# Altium schematic sheet driver.SchDoc
size A3
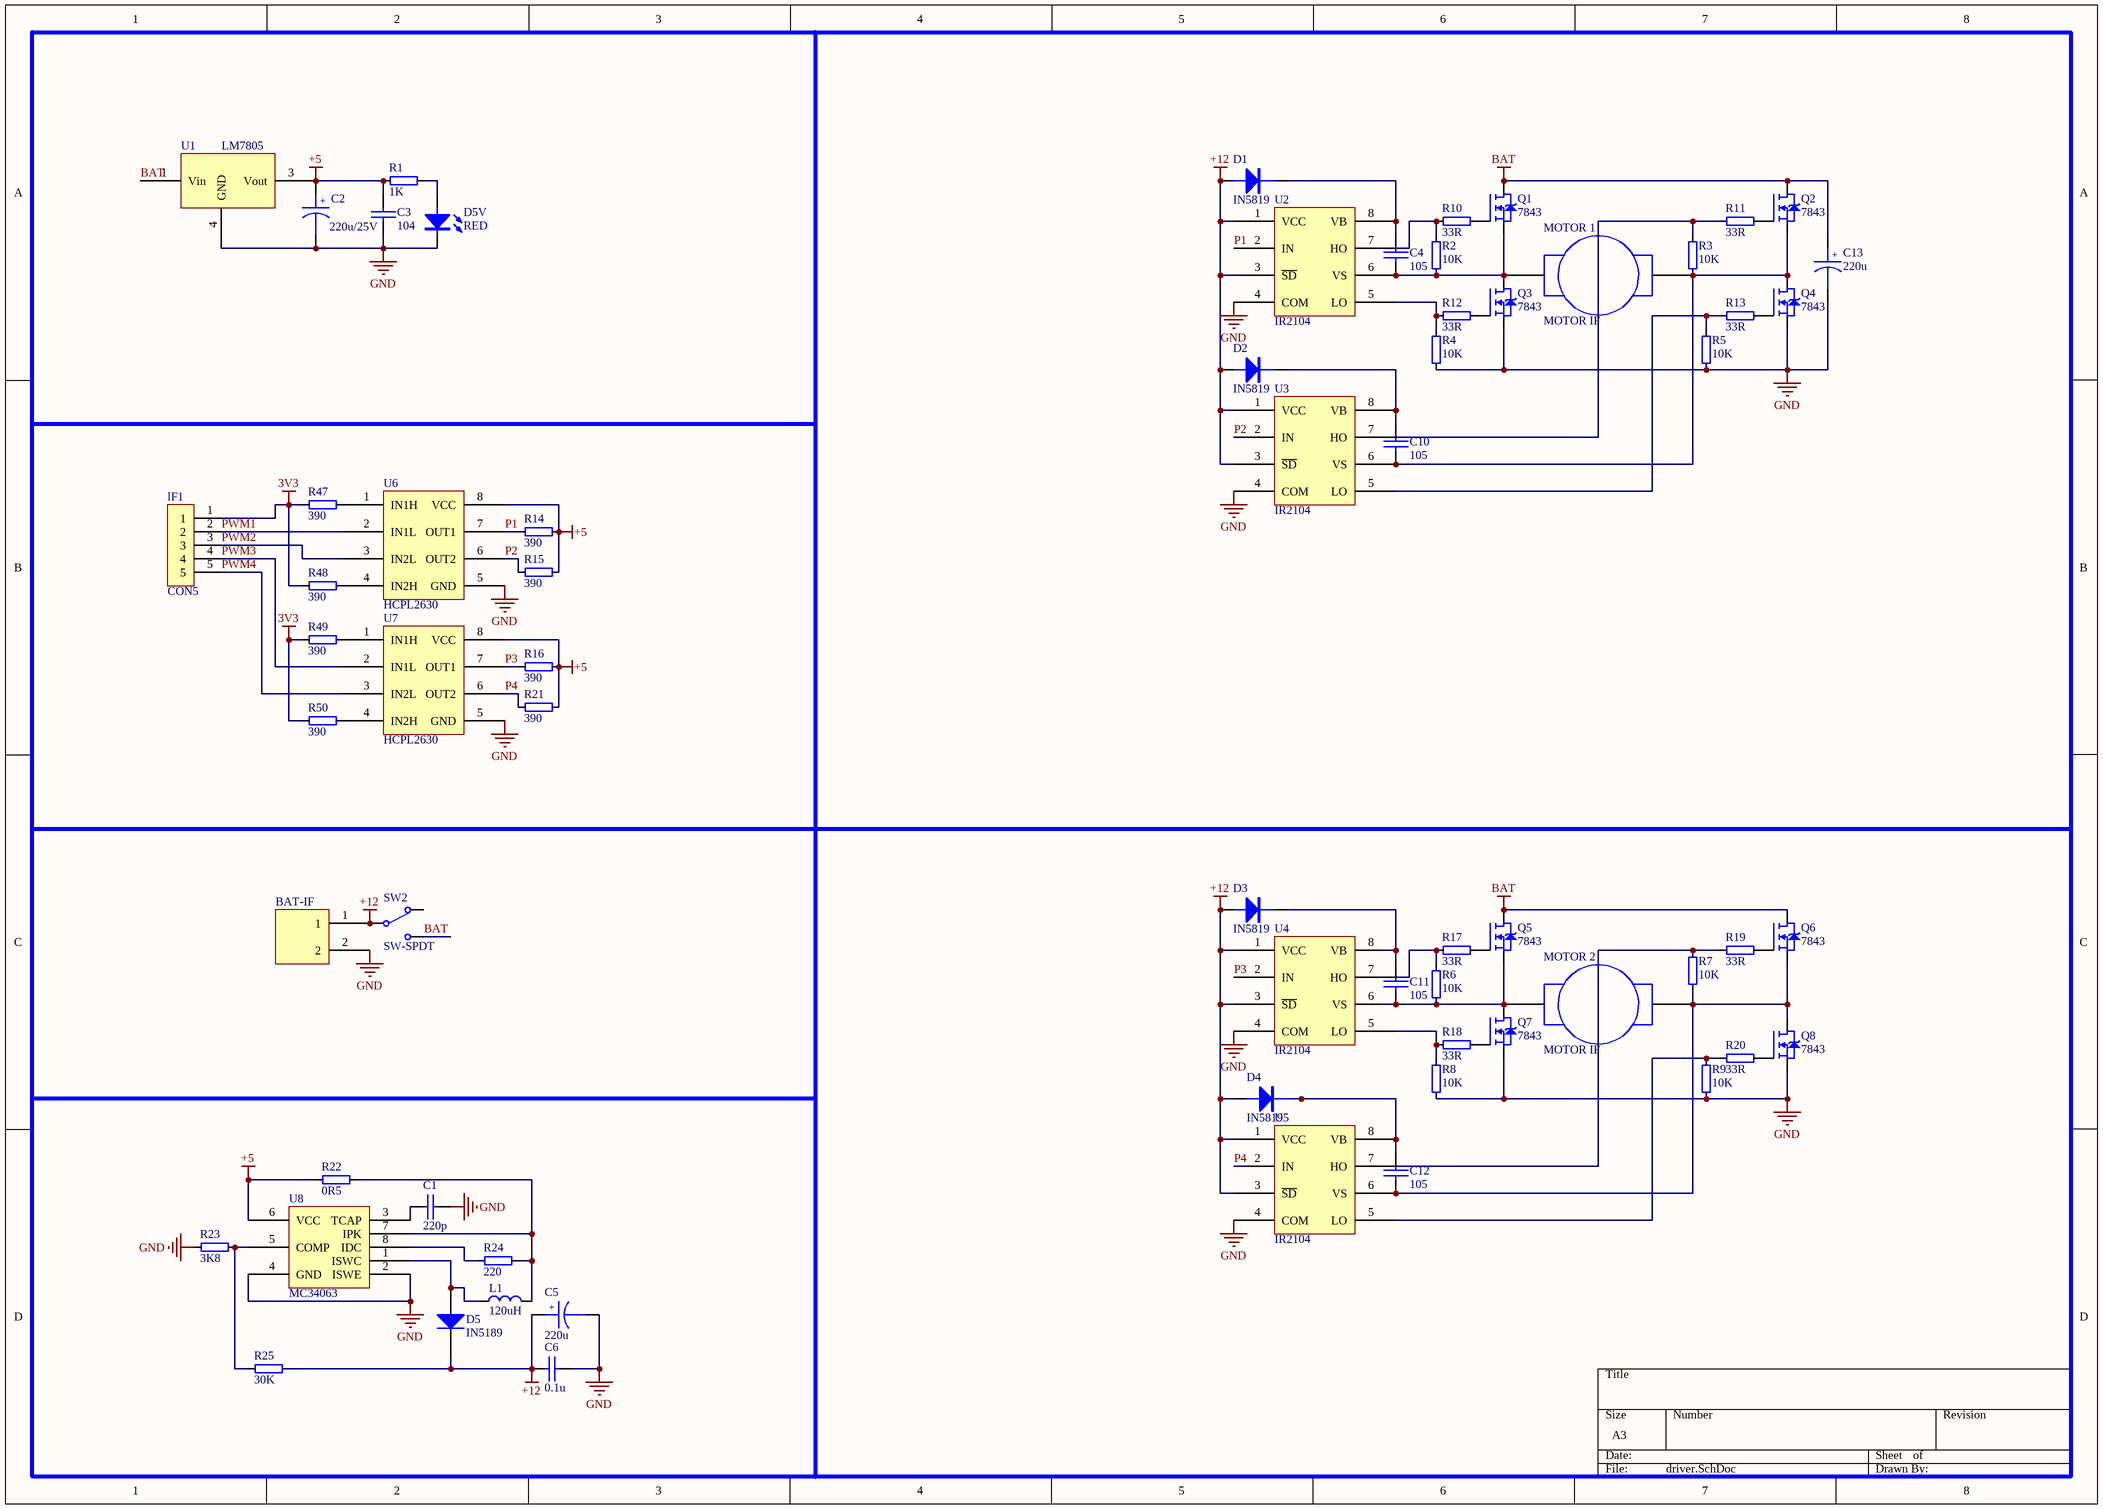
[diagram p0: driver.SchDoc]

## Parts
B1  BAT-IF  [KF301-2P]
C1  220p  [0603]
C2  220u/25V  [CAP 2.5*6.3*7 - BK]
C3  104  [0603]
C4  105  [0603]
C5  220u  [CAP 2.5*6.3*7 - BK]
C6  0.1u  [0603]
C10  105  [0603]
C11  105  [0603]
C12  105  [0603]
C13  220u  [CAP 2.5*6.3*7 - BK]
D1  IN5819  [SOD-123]
D2  IN5819  [SOD-123]
D3  IN5819  [SOD-123]
D4  IN5819  [SOD-123]
D5  IN5189  [SMA]
D5V  RED  [LED-0603]
L1  120uH  [L1210]
lF1  CON5  [2.54排针1X5]
MOTOR_1  MOTOR IF  [KF301-2P]
MOTOR_2  MOTOR IF  [KF301-2P]
Q1  7843  [TO-252]
Q2  7843  [TO-252]
Q3  7843  [TO-252]
Q4  7843  [TO-252]
Q5  7843  [TO-252]
Q6  7843  [TO-252]
Q7  7843  [TO-252]
Q8  7843  [TO-252]
R1  1K  [0603]
R2  10K  [0603]
R3  10K  [0603]
R4  10K  [0603]
R5  10K  [0603]
R6  10K  [0603]
R7  10K  [0603]
R8  10K  [0603]
R9  10K  [0603]
R10  33R  [0603]
R11  33R  [0603]
R12  33R  [0603]
R13  33R  [0603]
R14  390  [0603]
R15  390  [0603]
R16  390  [0603]
R17  33R  [0603]
R18  33R  [0603]
R19  33R  [0603]
R20  33R  [0603]
R21  390  [0603]
R22  0R5  [0603]
R23  3K8  [0603]
R24  220  [0603]
R25  30K  [0603]
R47  390  [0603]
R48  390  [0603]
R49  390  [0603]
R50  390  [0603]
SW2  SW-SPDT  [SW3-H2X3_8.6X4.5_L]
U1  LM7805  [TO-252]
U2  IR2104  [SO8_M]
U3  IR2104  [SO8_M]
U4  IR2104  [SO8_M]
U5  IR2104  [SO8_M]
U6  HCPL2630  [DIP-8]
U7  HCPL2630  [DIP-8]
U8  MC34063  [SO-8]

## Nets
3V3: lF1.1 R47.1 R48.1 R49.1 R50.1
+5: C2.1 C3.1 R1.1 R14.1 R15.1 R16.2 R21.1 R22.1 U1.3(Vout) U6.8(VCC) U7.8(VCC) U8.6(VCC)
+12: B1.1 C5.1 C6.1 D1.1 D2.1 D3.1 D4.1 D5.2(K) R25.2 SW2.2 U2.1(VCC) U2.3(~{SD}) U3.1(VCC) U3.3(~{SD}) U4.1(VCC) U4.3(~{SD}) U5.1(VCC) U5.3(~{SD})
BAT: C13.1 Q1.4(D) Q2.4(D) Q5.4(D) Q6.4(D) SW2.3 U1.1(Vin)
GND: B1.2 C1.2 C2.2 C3.2 C5.2 C6.2 C13.2 D5V.2(C) Q3.3(S) Q4.3(S) Q7.3(S) Q8.3(S) R4.1 R5.1 R8.1 R9.1 R23.1 U1.4(GND) U2.4(COM) U3.4(COM) U4.4(COM) U5.4(COM) U6.5(GND) U7.5(GND) U8.2(ISWE) U8.4(GND)
P1: R14.2 U2.2(IN) U6.7(OUT1)
P2: R15.2 U3.2(IN) U6.6(OUT2)
P3: R16.1 U4.2(IN) U7.7(OUT1)
P4: R21.2 U5.2(IN) U7.6(OUT2)
PWM1: lF1.2 U6.2(IN1L)
PWM2: lF1.3 U6.3(IN2L)
PWM3: lF1.4 U7.2(IN1L)
PWM4: lF1.5 U7.3(IN2L)
NetC1_1: C1.1 U8.3(TCAP)
NetC4_1: C4.1 D1.2 U2.8(VB)
NetC4_2: C4.2 MOTOR_1.2 Q1.3(S) Q3.4(D) R2.1 U2.6(VS)
NetC10_1: C10.1 D2.2 U3.8(VB)
NetC10_2: C10.2 MOTOR_1.1 Q2.3(S) Q4.4(D) R3.1 U3.6(VS)
NetC11_1: C11.1 D3.2 U4.8(VB)
NetC11_2: C11.2 MOTOR_2.2 Q5.3(S) Q7.4(D) R6.1 U4.6(VS)
NetC12_1: C12.1 D4.2 U5.8(VB)
NetC12_2: C12.2 MOTOR_2.1 Q6.3(S) Q8.4(D) R7.1 U5.6(VS)
NetD5_1: D5.1(A) L1.1 U8.1(ISWC)
NetD5V_1: D5V.1(A) R1.2
NetL1_2: L1.2 R22.2 R24.2 U8.7(IPK)
NetQ1_1: Q1.1(G) R10.2
NetQ2_1: Q2.1(G) R11.2
NetQ3_1: Q3.1(G) R12.2
NetQ4_1: Q4.1(G) R13.2
NetQ5_1: Q5.1(G) R17.2
NetQ6_1: Q6.1(G) R19.2
NetQ7_1: Q7.1(G) R18.2
NetQ8_1: Q8.1(G) R20.2
NetR2_2: R2.2 R10.1 U2.7(HO)
NetR3_2: R3.2 R11.1 U3.7(HO)
NetR4_2: R4.2 R12.1 U2.5(LO)
NetR5_2: R5.2 R13.1 U3.5(LO)
NetR6_2: R6.2 R17.1 U4.7(HO)
NetR7_2: R7.2 R19.1 U5.7(HO)
NetR8_2: R8.2 R18.1 U4.5(LO)
NetR9_2: R9.2 R20.1 U5.5(LO)
NetR23_2: R23.2 R25.1 U8.5(COMP)
NetR24_1: R24.1 U8.8(IDC)
NetR47_2: R47.2 U6.1(IN1H)
NetR48_2: R48.2 U6.4(IN2H)
NetR49_2: R49.2 U7.1(IN1H)
NetR50_2: R50.2 U7.4(IN2H)

Not connected (* = marked no-connect by the designer): SW2 1

## Notes on the sheet
- (in symbol 电解电容) +

## Library data of the parts
C1 C3 C4 C6 C10-C12 = 普通电容: Capacitor
C2 C5 C13 = 电解电容: Capacitor
D1-D4 = DIODE
D5 = Diode 1N5400: SS14; Published: 8-Jun-2000; LatestRevisionDate: 17-Jul-2002; LatestRevisionNote: Re-released for DXP Platform.; DatasheetVersion: 1998; PackageVersion: Aug-1999; PackageReference: DO-201AD; Publisher: Altium Limited; PackageDescription: Diode, Axial; Body 9.5 x 5.6 mm (LxDia. max), Lead Dia. 1.32 mm (max); ComponentLink1Description: Manufacturer Link; ComponentLink1URL: http://www.fairchildsemi.com/; ComponentLink2Description: Datasheet; ComponentLink2URL: http://www.fairchildsemi.com/ds/1N%2F1N5400.pdf
D5V = LED
L1 = INDUCTANCE
Q1-Q8 = FDB52N20_2: N-Channel MOSFET
R1-R25 R47-R50 = RES
SW2 = SWITCH-NKK-M201x: Switch
U1 = 7805